# EAGLE design emonTx4-ESP32 (EAGLE 9.6.2)
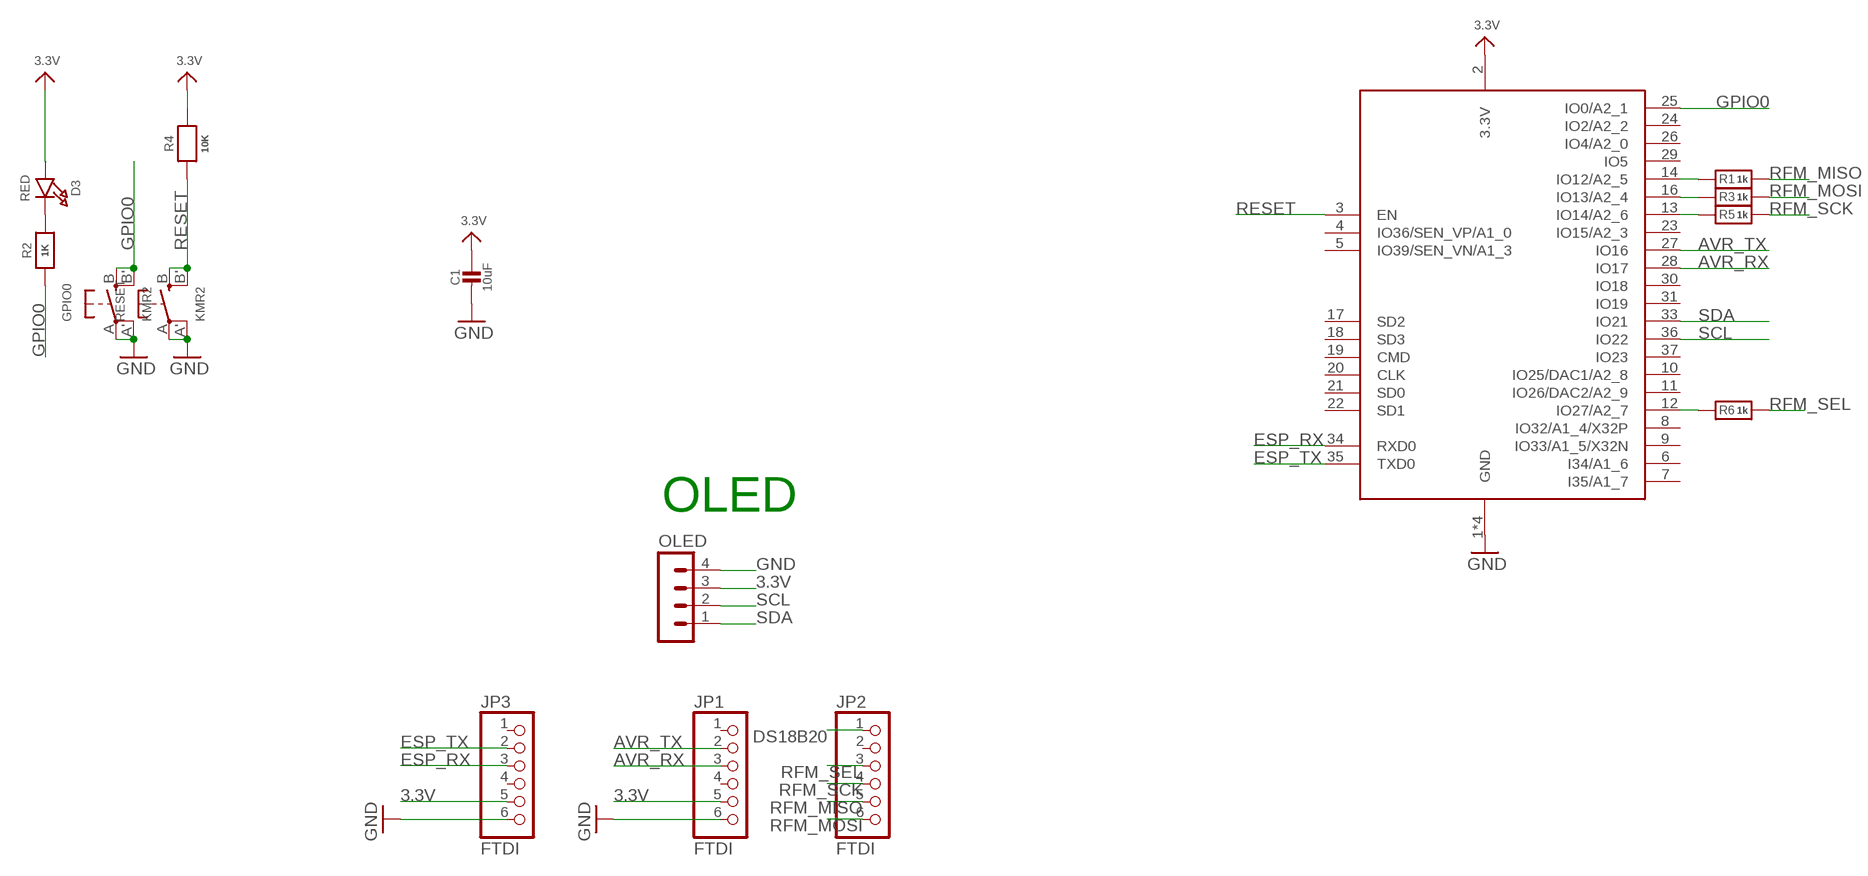
[diagram p0: schematic, sheet 1]

## Parts
C1  10uF  CAP_CERAMIC_0603  [_0603]
D3  RED  LED0603  [CHIPLED_0603]
GPIO0  KMR2  SWITCH_TACT_SMT4.6X2.8  [BTN_KMR2_4.6X2.8]
JP1  FTDI  HEADER-1X670MIL  [1X06_ROUND_70]
JP2  FTDI  HEADER-1X670MIL  [1X06_ROUND_70]
JP3  FTDI  HEADER-1X670MIL  [1X06_ROUND_70]
OLED  MA04-1-OLEDOLED  [MA04-1-OLED]
R1  1k  RESISTOR_0603  [_0603]
R2  1K  RESISTOR_0603  [_0603]
R3  1k  RESISTOR_0603  [_0603]
R4  10K  RESISTOR_0603  [_0603]
R5  1k  RESISTOR_0603  [_0603]
R6  1k  RESISTOR_0603  [_0603]
RESET  KMR2  SWITCH_TACT_SMT4.6X2.8  [BTN_KMR2_4.6X2.8]
X2  ESP32_WROOM32  [WROOM32]

## Nets
3.3V: C1.1 D3.A JP1.5 JP3.5 OLED.3 R4.2 X2.2(3.3V)
AVR_RX: JP1.3 X2.28(IO17)
AVR_TX: JP1.2 X2.27(IO16)
DS18B20: JP2.1
ESP_RX: JP3.3 X2.34(RXD0)
ESP_TX: JP3.2 X2.35(TXD0)
GND: C1.2 GPIO0.A'(P1) GPIO0.A(P) JP1.6 JP3.6 OLED.4 RESET.A'(P1) RESET.A(P) X2.1(GND) X2.15(GND) X2.38(GND) X2.P$1(GND)
GPIO0: GPIO0.B'(S1) GPIO0.B(S) R2.1 X2.25(IO0/A2_1)
N$1: D3.C R2.2
N$2: R1.2 X2.14(IO12/A2_5)
N$3: R3.2 X2.16(IO13/A2_4)
N$4: R5.2 X2.13(IO14/A2_6)
N$5: R6.2 X2.12(IO27/A2_7)
RESET: R4.1 RESET.B'(S1) RESET.B(S) X2.3(EN)
RFM_MISO: JP2.5 R1.1
RFM_MOSI: JP2.6 R3.1
RFM_SCK: JP2.4 R5.1
RFM_SEL: JP2.3 R6.1
SCL: OLED.2 X2.36(IO22)
SDA: OLED.1 X2.33(IO21)
Unconnected: JP1.1 JP1.4 JP2.2 JP3.1 JP3.4 X2.4(IO36/SEN_VP/A1_0) X2.5(IO39/SEN_VN/A1_3) X2.6(I34/A1_6) X2.7(I35/A1_7) X2.8(IO32/A1_4/X32P) X2.9(IO33/A1_5/X32N) X2.10(IO25/DAC1/A2_8) X2.11(IO26/DAC2/A2_9) X2.17(SD2) X2.18(SD3) X2.19(CMD) X2.20(CLK) X2.21(SD0) X2.22(SD1) X2.23(IO15/A2_3) X2.24(IO2/A2_2) X2.26(IO4/A2_0) X2.29(IO5) X2.30(IO18) X2.31(IO19) X2.37(IO23)

## Notes on the sheet
- OLED

## Library data of the parts
C1 = microbuilder:CAP_CERAMIC: Ceramic Capacitors For new designs, use the packages preceded by an '_' character since they are more reliable: The following footprints should be used on most boards: _0402 - Standard footprint for regular board layouts _0603 - Standard footprint for regular board layouts _0805 - Standard footprint for regular board layouts _1206 - Standard footprint for regular board layouts For extremely tight-pitch boards where space is at a premium, the following 'micro-pitch' footprints can be used (smaller pads, no silkscreen outline, etc.): _0402MP - Micro-pitch footprint for very dense/compact boards _0603MP - Micro-pitch footprint for very dense/compact boards _0805MP - Micro-pitch footprint for very dense/compact boards _1206MP - Micro-pitch footprint for very dense/compact boards
D3 = microbuilder:LED: LED 0603 - 0603 Surface Mount Package 2mA: Green LED - Low Power (3.9mcd, 2ma, 1.7Vf) - Digikey: 475-2709-2-ND Orange LED - Low Power (9.8mcd, 2ma, 1.8Vf) - Digikey: 475-1194-2-ND Red LED - Low Power (5mcd, 2ma, 1.8Vf) - Digikey: 475-1195-2-ND Yellow LED - Low Power (7mcd, 2ma, 1.8Vf) - Digikey: 475-1196-2-ND 5mA: Blue LED - Low Power (17mcd, 5ma, 2.9Vf) - Digikey: LNJ937W8CRACT-ND 0805 - 0805 Surface Mount Package 2mA: Red LED (8.8mcd, 2mA, 1.8Vf, Clear) - Low Power [Digikey: 475-2510-1-ND] Green LED (5mcd, 2mA, 1.8Vf, Clear) - Low Power [Digikey: 475-2730-1-ND] Yellow LED (11.3mcd, 2mA, 1.8Vf, Clear) - Low Power [Digikey: 475-2555-1-ND] 20mA: Red LED (104mcd, 20mA, Diffused) - LS R976 [Digikey: 475-1278-6-ND] Red LED (12mcd, 20mA, 2.0Vf, Clear) - APT2012EC [Digikey: 754-1128-1-ND] Green LED (15mcd, 20mA, 2.2Vf, Clear) - APT2012GC [Digikey: 754-1131-1-ND] Orange LED (160mcd, 20mA, 2.1Vf, Clear) - APT2012SECK [Digikey: 754-1130-1-ND] 1206 - 1206 Surface Mount Package Green LED (26mcd, 20mA, Diffused) - LG N971 [Digikey: 475-1407-6-ND] Red LED (15mcd, 20mA, Diffused) - LH N974 [Digikey: 475-1416-6-ND] Cree - Cree High-Power Surface Mount LEDs XPEBWT-L1-0000-00D50 - White 111lm 350mA 2.9Vf 6200K 110° XTEAWT-00-0000-00000LEE3 - White 114lm 350mA 2.85Vf 5000K 115° Everlight - Everlight 45-21 Series Surface Mount LEDs 45-21/QK2C-B2832AC2CB2/2T - Warm White 2000mcd 20mA 3.25Vf 3050K 120° 45-21/LK2C-B38452C4CB2/2T - Nuetral White 2000mcd 20mA 3.25Vf 4150K 120° 45-21/LK2C-B50634C6CB2/2T - Cold White 2200mcd 20mA 3.25Vf 5650K 120° PLCC2 Reverse Mount LS T77K-J1L2-1-0-2-R18-Z - Red 11.25mcd 2mA 1.8Vf 630nm 120° LO T77K-L1M2-24-Z - Orange 19.6mcd 2mA 1.8Vf 606nm 120° LY T77K-K2M1-26-Z - Yellow 15.7mcd 2mA 1.8Vf 587nm 120°
GPIO0 RESET = microbuilder:SWITCH_TACT_SMT: SMT Tact Switches 6x6mm - Digikey: P12940SCT-ND KMR2 (4.6x2.8mm) - Digikey: 401-1426-1-ND EVQ-PQHB55 - Light Touch, 160GF (4.5x4.5mm) - Digikey: P8090SCT-ND KMT0 - KMT021 NGJ LHS (etc.) IP68/Waterproof - Digikey: CKN10289CT-ND
JP1-JP3 = microbuilder:HEADER-1X6: PIN HEADER
OLED = con-lstb-db:MA04-1-OLED: PIN HEADER with OLED footprint.
R1-R6 = microbuilder:RESISTOR: Resistors For new designs, use the packages preceded by an '_' character since they are more reliable: The following footprints should be used on most boards: _0402 - Standard footprint for regular board layouts _0603 - Standard footprint for regular board layouts _0805 - Standard footprint for regular board layouts _1206 - Standard footprint for regular board layouts For extremely tight-pitch boards where space is at a premium, the following 'micro-pitch' footprints can be used (smaller pads, no silkscreen outline, etc.): _0402MP - Micro-pitch footprint for very dense/compact boards _0603MP - Micro-pitch footprint for very dense/compact boards _0805MP - Micro-pitch footprint for very dense/compact boards _1206MP - Micro-pitch footprint for very dense/compact boards
X2 = microbuilder:ESP32_WROOM32

## Net classes
1 power: width 0.254 mm, drill 0.5 mm, clearance 0.152 mm
2 gnd: width 0.254 mm, drill 0.5 mm, clearance 0.152 mm

## Board
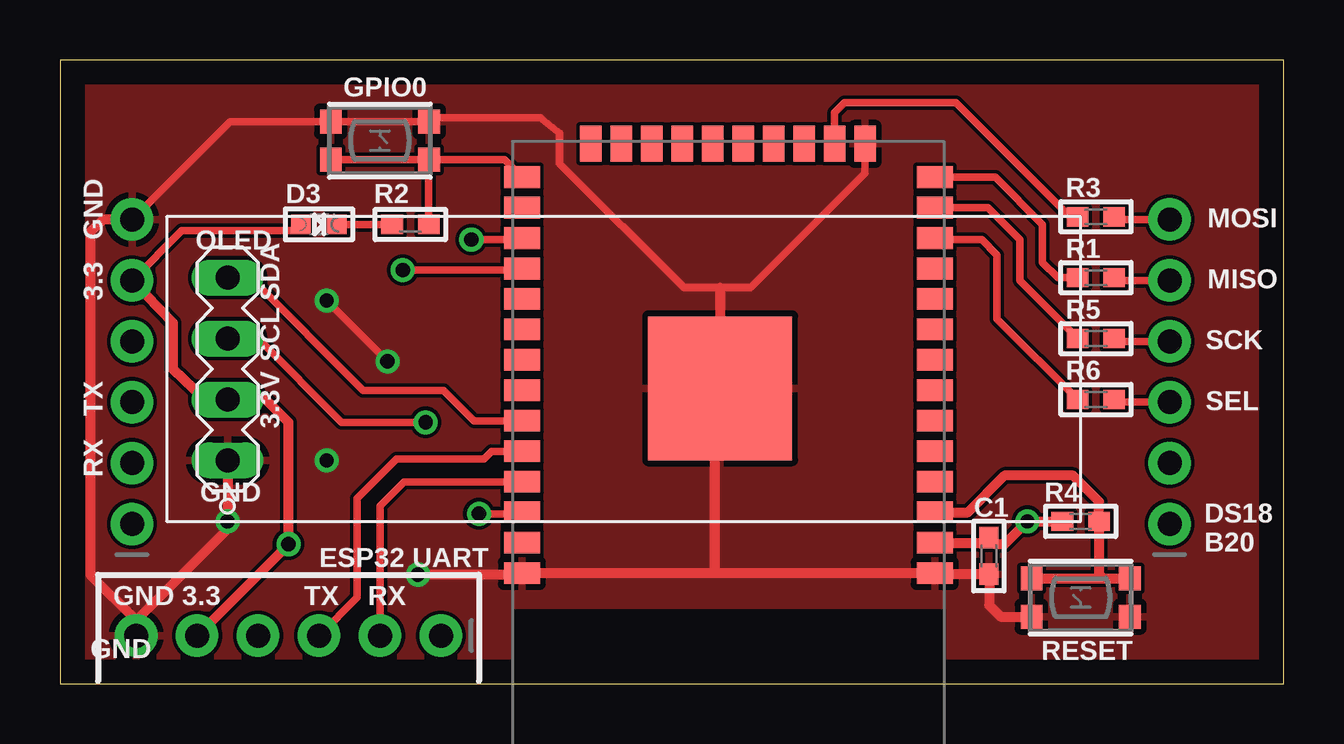
[diagram p1: board, top side]
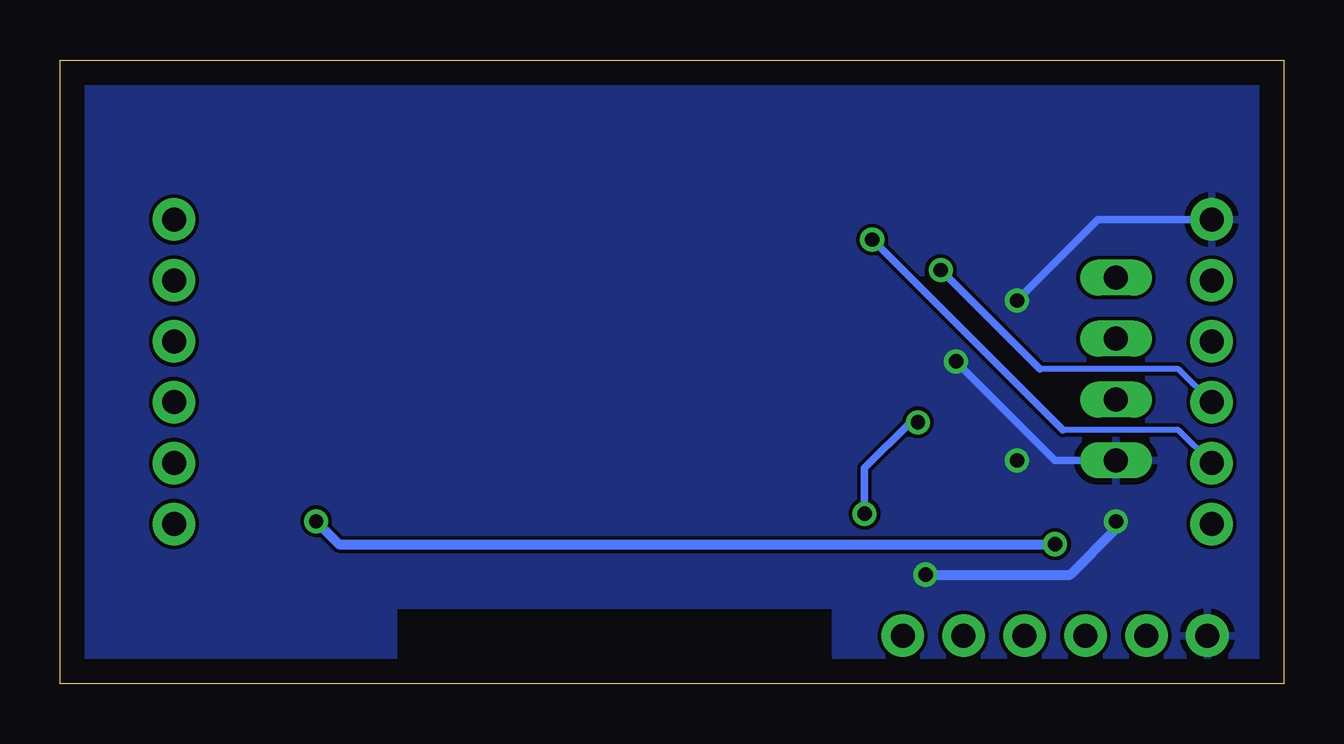
[diagram p2: board, bottom side, seen from below]

Size 51 x 26 mm. Coordinates in mm from the lower left corner, seen from the top.
Outline: 51,26 0,26 0,0 51,0 51,26
Copper layers (1*16): Top 0.035mm / dielectric 1.5mm / Bottom 0.035mm
Design rules "default *": minimum track width 6mil, minimum drill 0.35mm, track to track 6mil, track to pad 6mil, pad to pad 6mil, via to via 6mil, smd to smd 6mil, copper to edge 40mil, drill to drill 6mil, minimum pad ring 10mil, minimum via ring 8mil, stop-mask expansion 4mil, vias tented up to drill 0.6mm, thermal gap 10mil

### Footprints (pad centres in the part's own frame; a part is rotated, then mirrored left to right if it is on the bottom)
_0603 = smd 0.9 x 0.8: 1 -0.762,0; 2 0.762,0
CHIPLED_0603 = smd 0.8 x 0.8: A 0,-0.75; C 0,0.75
BTN_KMR2_4.6X2.8 = smd 0.9 x 1: A 2.05,0.8; A' -2.05,0.8; B 2.05,-0.8; B' -2.05,-0.8
1X06_ROUND_70 = drill 1 pad 1.778: 1 -6.35,0; 2 -3.81,0; 3 -1.27,0; 4 1.27,0; 5 3.81,0; 6 6.35,0
MA04-1-OLED = drill 1 long: 1 -3.81,0; 2 -1.27,0; 3 1.27,0; 4 3.81,0
WROOM32 = smd 1.5 x 0.9: 1 -8.6,5; 2 -8.6,3.73; 3 -8.6,2.46; 4 -8.6,1.19; 5 -8.6,-0.08; 6 -8.6,-1.35; 7 -8.6,-2.62; 8 -8.6,-3.89; 9 -8.6,-5.16; 10 -8.6,-6.43; 11 -8.6,-7.7; 12 -8.6,-8.97; 13 -8.6,-10.24; 14 -8.6,-11.51; 25 8.6,-11.51; 26 8.6,-10.24; 27 8.6,-8.97; 28 8.6,-7.7; 29 8.6,-6.43; 30 8.6,-5.16; 31 8.6,-3.89; 32 8.6,-2.62; 33 8.6,-1.35; 34 8.6,-0.08; 35 8.6,1.19; 36 8.6,2.46; 37 8.6,3.73; 38 8.6,5 | smd 0.9 x 1.5: 15 -5.7,-12.9; 16 -4.43,-12.9; 17 -3.16,-12.9; 18 -1.89,-12.9; 19 -0.62,-12.9; 20 0.65,-12.9; 21 1.92,-12.9; 22 3.19,-12.9; 23 4.46,-12.9; 24 5.73,-12.9 | smd 6 x 6: P$1 0.34,-2.7

### Placement (x,y rotation side)
C1  38.72,5.32 270 top
D3  10.79,19.14 270 top
GPIO0  13.34,22.64 0 top
JP1  3,13 90 top
JP2  46.25,13 90 top
JP3  9.53,2 180 top
OLED  6.99,13.11 270 top
R1  43.18,16.92 180 top
R2  14.61,19.14 180 top
R3  43.18,19.46 180 top
R4  42.55,6.76 180 top
R5  43.18,14.38 180 top
R6  43.18,11.84 180 top
RESET  42.55,3.59 180 top
X2  27.86,9.6 180 top

### Tracks (layer width: path | path; a pad name or v marks a point on that pad's centre or on a via)
3.3V  (via drill 0.6)
  Top 0.305: JP1.5 5.08,18.89 9.79,18.89 D3.A
  Top 0.406: JP3.5 v9.53,5.81 9.53,10.89 8.57,11.84 OLED.3 6.03,11.84 4.7,13.11 4.7,15.05 JP1.5 | 36.52,5.81 X2.2 38.51,5.87 C1.1 38.99,5.81 39.37,5.81 v40.32,6.76 R4.2
  Bottom 0.406: v40.32,6.76 39.37,5.81 v9.53,5.81
AVR_RX  (via drill 0.6)
  Top 0.305: X2.28 19.2,17.24 v14.29,17.24
  Bottom 0.254: JP1.3 4.38,13.11 10.16,13.11
  Bottom 0.305: 10.16,13.11 13.02,15.97 v14.29,17.24
AVR_TX  (via drill 0.6)
  Top 0.305: X2.27 19.2,18.51 v17.14,18.51
  Bottom 0.254: JP1.2 4.38,10.57 9.21,10.57
  Bottom 0.305: 9.21,10.57 14.29,15.65 v17.14,18.51
ESP_RX
  Top 0.305: JP3.3 12.38,3.59 12.38,7.71 14.03,9.37 17.67,9.37 17.99,9.68 X2.34
ESP_TX
  Top 0.305: JP3.2 13.34,7.4 14.35,8.41 X2.35
GND  (via drill 0.6)
  Top 0.305: JP1.6 7.09,23.44 GPIO0.A' GPIO0.A 15.54,23.59 20,23.59 20.83,22.95 20.83,21.68 26.01,16.5 27.52,16.5 28.79,16.5 33.56,21.27 X2.15 | v13.65,13.43 v11.11,15.97
  Top 0.406: RESET.A 39.22,2.79 38.73,3.27 38.73,4.54 C1.2 36.51,4.56 X2.1 27.3,4.6 | 27.3,4.6 X2.38 19.2,4.54 v14.92,4.54 | 27.3,4.6 27.3,12.09 X2.P$1 27.52,16.5 | 33.66,22.41 X2.15 | OLED.4 v6.99,6.76 6.99,6.45 3.17,2.63 | 3.17,2.63 JP3.6 | JP1.6 1.79,19.35 1.27,18.83 1.27,4.54 3.17,2.63
  Bottom 0.305: JP1.6 7.73,19.35 v11.11,15.97 | v13.65,13.43 9.53,9.3 OLED.4
  Bottom 0.406: v14.92,4.54 8.89,4.54 6.99,6.45 v6.99,6.76
  other vias: 11.11,9.3
  pour Top: -1.27,27.4 -1.27,-1.17 18.67,-1.17 18.67,3.27 37.08,3.27 37.08,-1.17 52.07,-1.17 52.07,27.4
  pour Bottom: -0.64,26.77 -0.64,-0.54 18.67,-0.54 18.67,3.27 37.08,3.27 37.08,-0.54 51.44,-0.54 51.44,26.77
GPIO0
  Top 0.305: GPIO0.B 18.54,21.84 X2.25 | GPIO0.B GPIO0.B' 11.25,21.88 | R2.1 15.37,21.82 GPIO0.B
N$1
  Top 0.305: R2.2 D3.C
N$2
  Top 0.305: R1.2 41.59,16.92 40.96,17.56 40.96,19.14 38.99,21.11 X2.14
N$3
  Top 0.305: R3.2 42.1,19.46 37.34,24.23 32.7,24.23 32.29,23.81 X2.16
N$4
  Top 0.305: R5.2 40.01,16.8 40.01,18.51 38.67,19.84 X2.13
N$5
  Top 0.305: R6.2 39.05,15.21 39.05,17.88 38.42,18.51 36.52,18.51 X2.12
RESET
  Top 0.406: RESET.B 43.5,4.39 | 43.5,4.39 RESET.B' | X2.3 37.85,7.14 39.37,8.67 42.23,8.67 43.31,7.59 R4.1 43.31,4.58 43.5,4.39
RFM_MISO
  Top 0.305: JP2.5 44.05,16.81 R1.1
RFM_MOSI
  Top 0.305: JP2.6 44.05,19.35 R3.1
RFM_SCK
  Top 0.305: JP2.4 44.05,14.27 R5.1
RFM_SEL
  Top 0.305: JP2.3 44.05,11.73 R6.1
SCL  (via drill 0.6)
  Top 0.305: X2.36 19.2,7.08 v17.46,7.08 | OLED.2 8.26,14.38 11.75,10.89 v15.24,10.89
  Bottom 0.305: v17.46,7.08 17.46,8.98 15.56,10.89 v15.24,10.89
SDA
  Top 0.305: X2.33 17.26,10.95 15.99,12.22 12.64,12.22 7.94,16.92 OLED.1

### Text on the board
tNames: GND | MOSI | 3.3 | SDA | MISO | SCK | SCL | TX | 3.3V | SEL | RX | GND | ESP32 UART | DS18 / B20 | GND | 3.3 | TX | RX | GND